# EAGLE design Kimera_core_v1.0 (EAGLE 7.3.0)
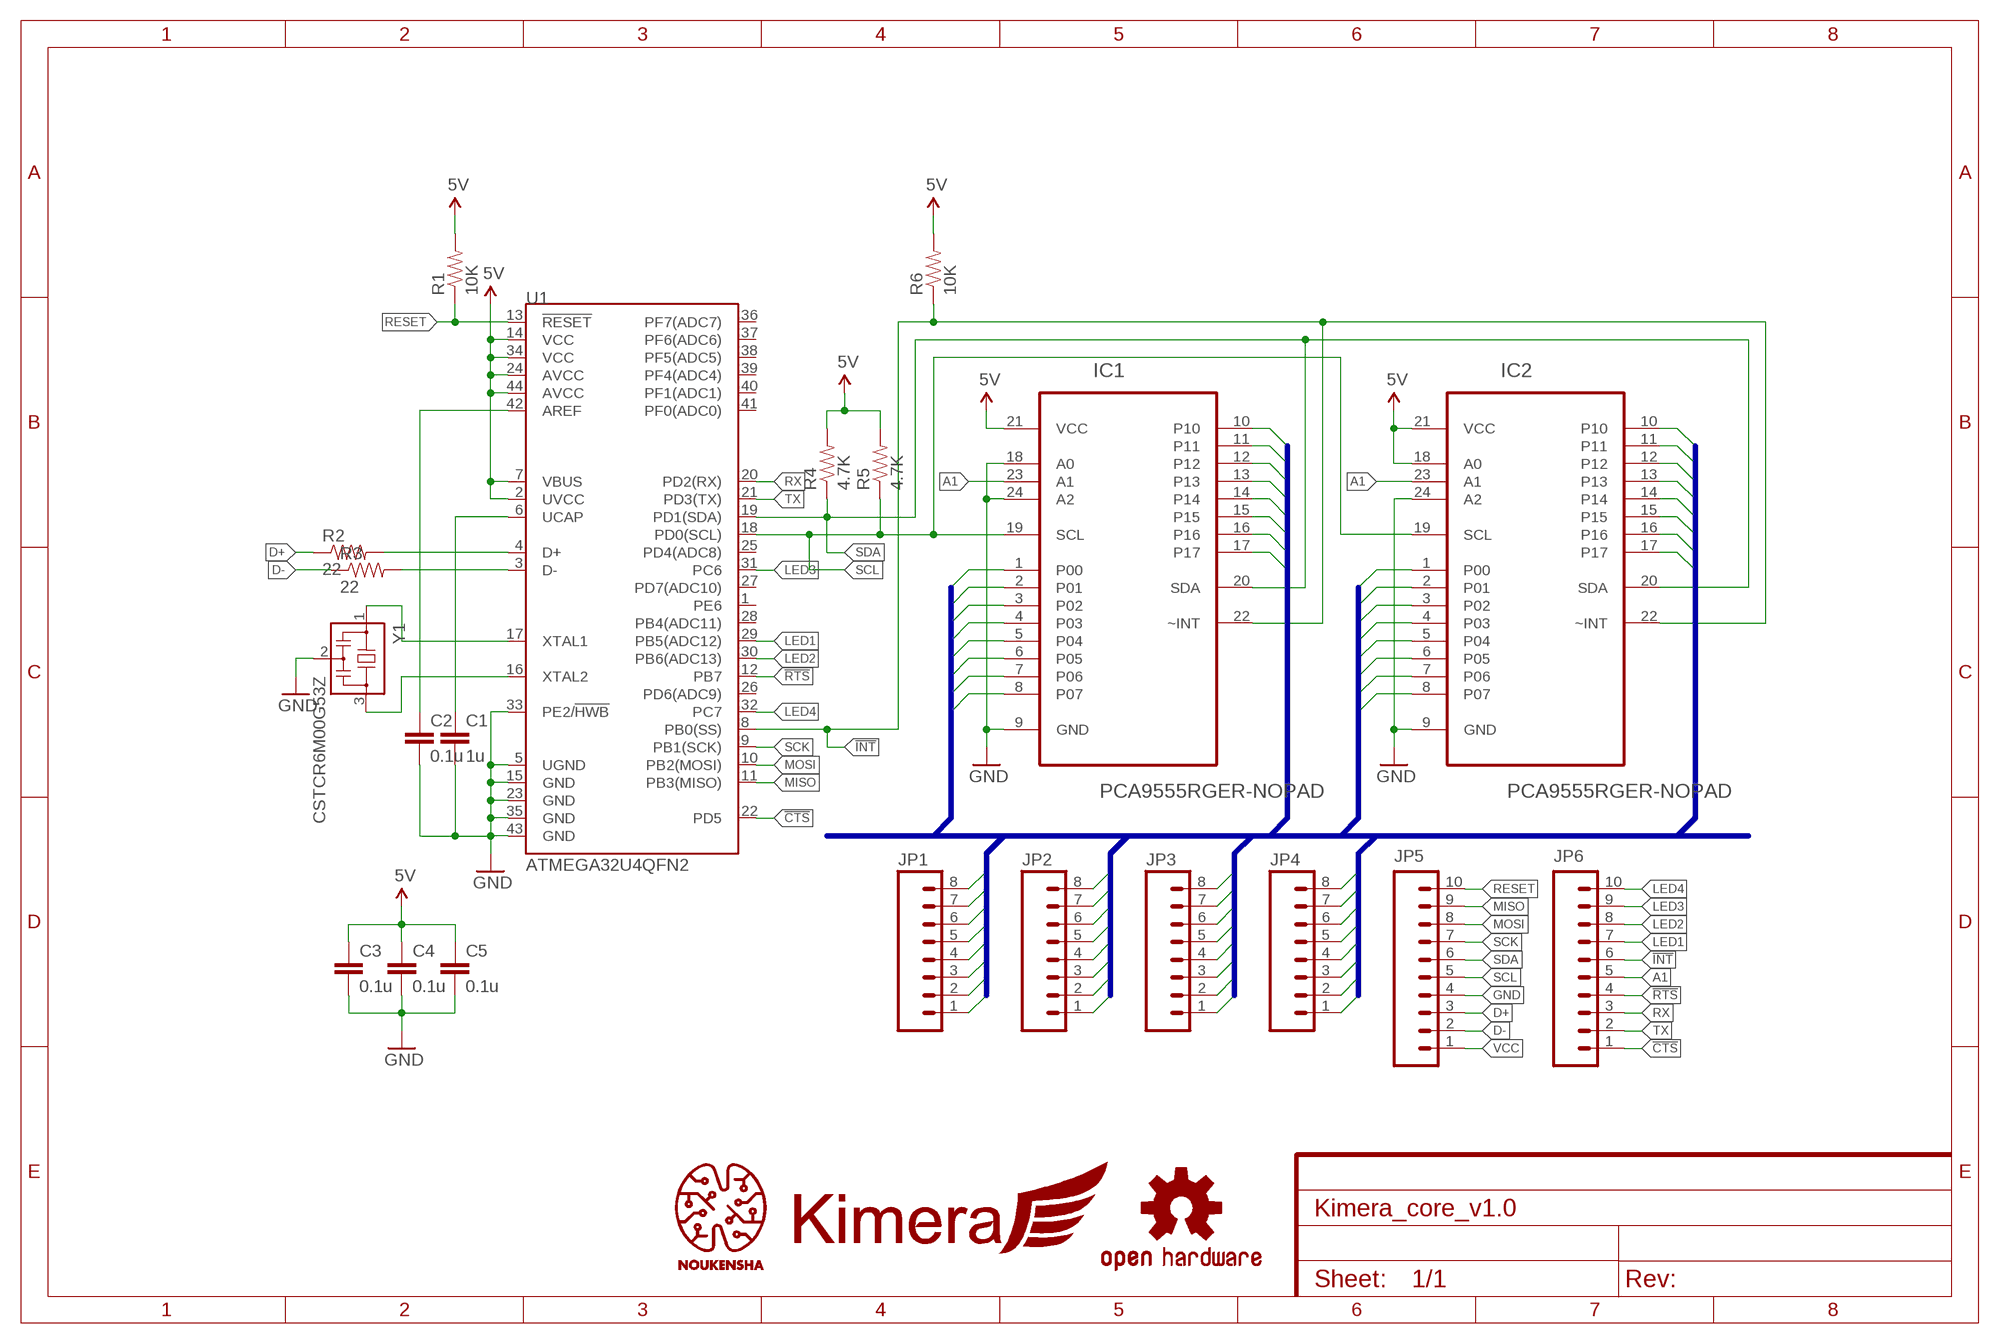
[diagram p0: schematic, sheet 1]
FRAME1 (FRAME-A4L): CNAME: Noukensha; CREVISION: 1.0; DESIGNER: Kai Ryu

## Parts
C1  1u  CAP0402-CAP  [0402-CAP]
C2  0.1u  CAP0402-CAP  [0402-CAP]
C3  0.1u  CAP0402-CAP  [0402-CAP]
C4  0.1u  CAP0402-CAP  [0402-CAP]
C5  0.1u  CAP0402-CAP  [0402-CAP]
IC1  PCA9555RGER-NOPAD  [QFN50P400X400X100-25N-NOPAD]
IC2  PCA9555RGER-NOPAD  [QFN50P400X400X100-25N-NOPAD]
JP1  P08  [P08]
JP2  P08  [P08]
JP3  P08  [P08]
JP4  P08  [P08]
JP5  P10  [P10]
JP6  P10  [P10]
LOGO1  KIMERA_LOGO  [KIMERA_LOGO]
LOGO2  NOUKENSHA_LOGONIX  [NOUKENSHA_LOGO_NIX]
LOGO3  OSHW_LOGONIX  [OSHW_LOGO_NIX]
R1  10K  RESISTOR0402-RES  [0402-RES]
R2  22  RESISTOR0402-RES  [0402-RES]
R3  22  RESISTOR0402-RES  [0402-RES]
R4  4.7K  RESISTOR0402-RES  [0402-RES]
R5  4.7K  RESISTOR0402-RES  [0402-RES]
R6  10K  RESISTOR0402-RES  [0402-RES]
U1  ATMEGA32U4QFN2  [QFN-44-NOPAD]
Y1  CSTCR6M00G53Z  [CSTER12M]

## Nets
!CTS: JP6.1 U1.22(PD5)
!INT: IC1.22(~INT) IC2.22(~INT) JP6.6 R6.1 U1.8(PB0(SS))
!RTS: JP6.4 U1.12(PB7)
A1: IC1.23(A1) IC2.23(A1) JP6.5
D+: JP5.3 R2.1
D-: JP5.2 R3.1
GND: C1.2 C2.2 C3.2 C4.2 C5.2 IC1.9(GND) IC1.18(A0) IC1.24(A2) IC2.9(GND) IC2.24(A2) JP5.4 U1.5(UGND) U1.15(GND) U1.23(GND) U1.33(PE2/!HWB) U1.35(GND) U1.43(GND) Y1.2
LED1: JP6.7 U1.29(PB5(ADC12))
LED2: JP6.8 U1.30(PB6(ADC13))
LED3: JP6.9 U1.31(PC6)
LED4: JP6.10 U1.32(PC7)
MISO: JP5.9 U1.11(PB3(MISO))
MOSI: JP5.8 U1.10(PB2(MOSI))
N$1: C2.1 U1.42(AREF)
N$2: R2.2 U1.4(D+)
N$3: U1.17(XTAL1) Y1.1
N$4: U1.16(XTAL2) Y1.3
N$5: R3.2 U1.3(D-)
N$6: C1.1 U1.6(UCAP)
P1: IC1.1(P00) JP1.1
P2: IC1.2(P01) JP1.2
P3: IC1.3(P02) JP1.3
P4: IC1.4(P03) JP1.4
P5: IC1.5(P04) JP1.5
P6: IC1.6(P05) JP1.6
P7: IC1.7(P06) JP1.7
P8: IC1.8(P07) JP1.8
P9: IC1.10 JP2.1
P10: IC1.11 JP2.2
P11: IC1.12 JP2.3
P12: IC1.13 JP2.4
P13: IC1.14 JP2.5
P14: IC1.15 JP2.6
P15: IC1.16 JP2.7
P16: IC1.17 JP2.8
P17: IC2.1(P00) JP3.1
P18: IC2.2(P01) JP3.2
P19: IC2.3(P02) JP3.3
P20: IC2.4(P03) JP3.4
P21: IC2.5(P04) JP3.5
P22: IC2.6(P05) JP3.6
P23: IC2.7(P06) JP3.7
P24: IC2.8(P07) JP3.8
P25: IC2.10 JP4.1
P26: IC2.11 JP4.2
P27: IC2.12 JP4.3
P28: IC2.13 JP4.4
P29: IC2.14 JP4.5
P30: IC2.15 JP4.6
P31: IC2.16 JP4.7
P32: IC2.17 JP4.8
RESET: JP5.10 R1.1 U1.13(!RESET)
RX: JP6.3 U1.20(PD2(RX))
SCK: JP5.7 U1.9(PB1(SCK))
SCL: IC1.19(SCL) IC2.19(SCL) JP5.5 R5.1 U1.18(PD0(SCL))
SDA: IC1.20(SDA) IC2.20(SDA) JP5.6 R4.1 U1.19(PD1(SDA))
TX: JP6.2 U1.21(PD3(TX))
VCC: C3.1 C4.1 C5.1 IC1.21(VCC) IC2.18(A0) IC2.21(VCC) JP5.1 R1.2 R4.2 R5.2 R6.2 U1.2(UVCC) U1.7(VBUS) U1.14(VCC) U1.24(AVCC) U1.34(VCC) U1.44(AVCC) ; supply symbol labelled 5V
Unconnected: U1.1(PE6) U1.25(PD4(ADC8)) U1.26(PD6(ADC9)) U1.27(PD7(ADC10)) U1.28(PB4(ADC11)) U1.36(PF7(ADC7)) U1.37(PF6(ADC6)) U1.38(PF5(ADC5)) U1.39(PF4(ADC4)) U1.40(PF1(ADC1)) U1.41(PF0(ADC0))

## Buses
P[1..32]

## Library data of the parts
C1-C5 = SparkFun-Passives:CAP: Capacitor Standard 0603 ceramic capacitor, and 0.1" leaded capacitor.
IC1 IC2 = pca9555:PCA9555RGER-NOPAD: 16-BIT I/O EXPANDER
JP1-JP4 = castellation:P08
JP5 JP6 = castellation:P10
LOGO1 = logo:KIMERA_LOGO
LOGO2 = logo:NOUKENSHA_LOGO
LOGO3 = logo:OSHW_LOGO: Open Source Hardware Logo This logo indicates the piece of hardware it is found on incorporates a OSHW license and/or adheres to the definition of open source hardware found here: http://freedomdefined.org/OSHW
R1-R6 = SparkFun-Passives:RESISTOR: Resistor Basic schematic elements and footprints for 0603, 1206, and PTH resistors.
U1 = SparkFun-DigitalIC:ATMEGA32U4: Atmel 44-pin 8-bit Microcontroller with 32KBytes of ISP Flash and USB Controller
Y1 = cstce-resonator:CSTCR: Resonator Source: murata.co.jp; MPN: CSTCC12M0; OC_FARNELL: 1170434; OC_NEWARK: 25M8759

## Board
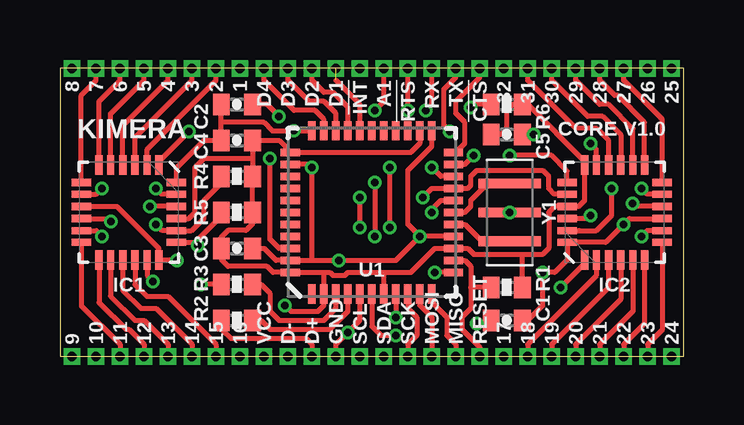
[diagram p1: board, top side]
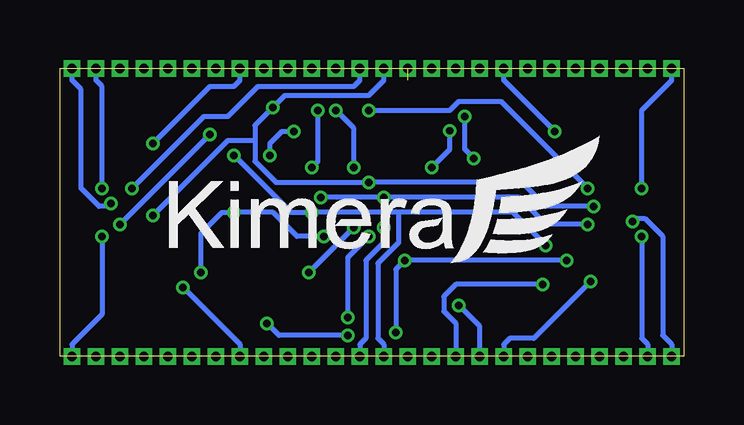
[diagram p2: board, bottom side, seen from below]

Size 26 x 12 mm. Coordinates in mm from the lower left corner, seen from the top.
Outline: 0,0 26,0 26,12 0,12 0,0
Copper layers (1*16): Top 0.035mm / dielectric 1.5mm / Bottom 0.035mm
Design rules "SeeedStudio_2layer_DRU_no_angle_20140221 *": minimum track width 6mil, minimum drill 10mil, track to track 6mil, track to pad 6mil, pad to pad 6mil, via to via 6mil, smd to smd 0mil, copper to edge 0mil, drill to drill 10mil, minimum pad ring 6mil, minimum via ring 5mil, stop-mask expansion 2mil, vias tented up to drill 100mil, thermal gap 10mil

### Footprints (pad centres in the part's own frame; a part is rotated, then mirrored left to right if it is on the bottom)
0402-CAP = smd 0.7 x 0.9: 1 -0.65,0; 2 0.65,0
QFN50P400X400X100-25N-NOPAD = smd 0.813 x 0.305: 1 -1.981,1.245; 2 -1.981,0.762; 3 -1.981,0.254; 4 -1.981,-0.254; 5 -1.981,-0.762; 6 -1.981,-1.245; 13 1.981,-1.245; 14 1.981,-0.762; 15 1.981,-0.254; 16 1.981,0.254; 17 1.981,0.762; 18 1.981,1.245 | smd 0.305 x 0.813: 7 -1.245,-1.981; 8 -0.762,-1.981; 9 -0.254,-1.981; 10 0.254,-1.981; 11 0.762,-1.981; 12 1.245,-1.981; 19 1.245,1.981; 20 0.762,1.981; 21 0.254,1.981; 22 -0.254,1.981; 23 -0.762,1.981; 24 -1.245,1.981
P08 = drill 0.4 pad 0.7 square: 1 0,0; 2 1,0; 3 2,0; 4 3,0; 5 4,0; 6 5,0; 7 6,0; 8 7,0
P10 = drill 0.4 pad 0.7 square: 1 0,0; 2 1,0; 3 2,0; 4 3,0; 5 4,0; 6 5,0; 7 6,0; 8 7,0; 9 8,0; 10 9,0
0402-RES = smd 0.7 x 0.9: 1 -0.65,0; 2 0.65,0
QFN-44-NOPAD = smd 0.8 x 0.3: 1 -3.4,2.5; 2 -3.4,2; 3 -3.4,1.5; 4 -3.4,1; 5 -3.4,0.5; 6 -3.4,0; 7 -3.4,-0.5; 8 -3.4,-1; 9 -3.4,-1.5; 10 -3.4,-2; 11 -3.4,-2.5; 23 3.4,-2.5; 24 3.4,-2; 25 3.4,-1.5; 26 3.4,-1; 27 3.4,-0.5; 28 3.4,0; 29 3.4,0.5; 30 3.4,1; 31 3.4,1.5; 32 3.4,2; 33 3.4,2.5 | smd 0.3 x 0.8: 12 -2.5,-3.4; 13 -2,-3.4; 14 -1.5,-3.4; 15 -1,-3.4; 16 -0.5,-3.4; 17 0,-3.4; 18 0.5,-3.4; 19 1,-3.4; 20 1.5,-3.4; 21 2,-3.4; 22 2.5,-3.4; 34 2.5,3.4; 35 2,3.4; 36 1.5,3.4; 37 1,3.4; 38 0.5,3.4; 39 0,3.4; 40 -0.5,3.4; 41 -1,3.4; 42 -1.5,3.4; 43 -2,3.4; 44 -2.5,3.4
CSTER12M = smd 0.4 x 2.6: 1 -1.2,0; 2 0,0; 3 1.2,0

### Placement (x,y rotation side)
C1  18.62,1.5 0 top
C2  7.38,10.5 180 top
C3  7.38,4.5 0 top
C4  7.38,9 180 top
C5  18.62,9.25 0 top
IC1  2.88,6 270 top
IC2  23.12,6 90 top
JP1  7.5,12 180 top
JP2  0.5,0 0 top
JP3  18.5,0 0 top
JP4  25.5,12 180 top
JP5  8.5,0 0 top
JP6  17.5,12 180 top
LOGO1  22,4 0 bottom
LOGO2  -4.5,-5.5 0 top  (outside the outline)
LOGO3  -5.5,-7 0 top  (outside the outline)
R1  18.62,2.88 0 top
R2  7.38,1.5 0 top
R3  7.38,3 0 top
R4  7.38,7.5 0 top
R5  7.38,6 0 top
R6  18.62,10.5 0 top
U1  13,6 90 top
Y1  18.75,6 270 top

### Tracks (layer width: path | path; a pad name or v marks a point on that pad's centre or on a via)
!CTS
  Top 0.203: U1.22 16.5,8.5 16.88,8.88 16.88,9.75 16.5,10.12 16.5,10.62 17.5,11.62 JP6.1
!INT  (via drill 0.3)
  Top 0.203: IC1.22 v3.75,6.25 | IC2.22 22,5.75 v22.12,5.88 | U1.8 v14,1.62 | v13.12,7.25 v13.12,5 | 17.98,10.47 R6.1 17.25,10.5 v17.12,10.38
  Bottom 0.203: v3.75,6.25 5.75,6.25 6.75,7.25 v13.12,7.25 17,7.25 17.88,8.12 17.88,9 | v14,1.62 14,4.12 v13.12,5 | v22.12,5.88 19,9 17.88,9 | JP6.6 12.5,11.5 13.12,10.88 16.62,10.88 v17.12,10.38 17.88,9.62 17.88,9
!RTS  (via drill 0.3)
  Top 0.203: U1.12 v15.62,3.5 | v13.75,5.38 v13.75,7.88 | v14.5,10.25 JP6.4
  Bottom 0.203: v15.62,3.5 v13.75,5.38 | v13.75,7.88 13.75,9.5 v14.5,10.25
A1  (via drill 0.3)
  Top 0.203: IC1.23 4.24,6.76 v4,7 | 21.64,5.24 IC2.23 22.36,5.24 23,5.88 v23,7 | v13.12,10.25 13.5,10.62 JP6.5
  Bottom 0.203: v4,7 7.62,10.62 9.38,10.62 9.75,10.25 v13.12,10.25 | v23,7 20,10 19,10 17.75,11.25 13.75,11.25 13.5,11.5 JP6.5
D+
  Top 0.203: R2.1 6.72,1.15 7.12,0.75 10.25,0.75 10.5,0.5 JP5.3
D-  (via drill 0.3)
  Top 0.203: R3.1 v5.88,3
  Bottom 0.203: v5.88,3 9.5,3 10,2.5 10,1.88 9.5,1.38 JP5.2
GND  (via drill 0.3)
  Top 0.203: v15,5 14.5,5.5 14.5,7.75 15.5,8.75 U1.23 | 10.5,4 v10.5,7.88 10.38,8 U1.35 | JP5.4 11.5,0.5 v12,1 12.5,1.5 U1.5 | IC1.9 2.37,6.25 4.12,4.5 IC1.18 4.14,4 v4.88,4 | IC2.9 23.75,5.75 v23.5,5.5 22.75,4.75 IC2.24 | C3.2 8.5,4.5 9,4 U1.43 10.5,4 | 6.75,9.03 C4.2 | C4.2 6.72,9.75 | 6.72,9.75 C2.2 | C1.2 19.5,1.5 20.12,2.12 v20.12,3.5 20.62,3.5 21.15,4.02 IC2.24 | 6.72,9.75 8.5,9.75 8.85,9.4 v9.75,9.4 U1.33 | U1.33 | 10.5,4 v11.62,4 14,4 v15,5 | U1.33 | C5.2 v19.75,9.25 | IC2.24 | IC1.24 4.86,7.86 6,9 C4.2 | U1.15 v15,5
  Bottom 0.203: v15,5 16.12,5 17.12,6 Y1.2 19.25,6 20.12,5.12 v20.12,3.5 | v12,1 12,3.62 v11.62,4 v4.88,4 | v10.5,7.88 9.75,8.62 v9.75,9.4 | v23.5,5.5 v19.75,9.25
  other vias: 18.75,6
LED1  (1 unrouted)
  Top 0.203: U1.29 12.5,10.5 11.5,11.5
LED2
  Top 0.203: U1.30 12,10.38 11.38,11 11,11 10.5,11.5 JP6.8
LED3
  Top 0.203: U1.31 11.5,10.12 11,10.62 10.38,10.62 9.5,11.5 JP6.9
LED4
  Top 0.203: U1.32 11,9.88 10.62,10.25 9.75,10.25 8.5,11.5 JP6.10
MISO
  Top 0.203: U1.11 15.5,2.25 16.12,1.62 16.12,0.88 16.5,0.5 JP5.9
MOSI
  Top 0.203: U1.10 15,2.12 15.5,1.62 JP5.8
N$1  (via drill 0.3)
  Top 0.203: U1.42 9.12,4.5 8.75,4.88 v8.75,8.25 | v9.12,10 8.62,10.5 C2.1
  Bottom 0.203: v8.75,8.25 9.12,8.62 v9.12,10
N$2
  Top 0.203: R2.2 8.38,1.5 8.75,1.12 11.25,1.12 12,1.88 U1.4
N$3
  Top 0.203: U1.17 16.88,6 17.12,6.25 17.12,6.5 17.88,7.25 18.7,7.25 Y1.1
N$4
  Top 0.203: U1.16 16.88,5.5 17.62,4.75 18.7,4.75 Y1.3
N$5
  Top 0.203: R3.2 8.38,3 8.75,2.62 8.75,1.88 9.12,1.5 11,1.5 11.5,2 U1.3
N$6  (via drill 0.3)
  Top 0.203: U1.6 13,1.25 13.38,0.88 v14,0.88 | C1.1 17.85,1.38 v17.38,1.38
  Bottom 0.203: v14,0.88 16.88,0.88 v17.38,1.38
P1  (via drill 0.3)
  Top 0.203: v5.38,9.38 4.12,8.12 IC1.1
  Bottom 0.203: v5.38,9.38 7.5,11.5 JP1.1
P2
  Top 0.203: IC1.2 3.64,8.64 6.5,11.5 JP1.2
P3
  Top 0.203: IC1.3 3.13,9.13 5.5,11.5 JP1.3
P4
  Top 0.203: IC1.4 2.62,9.62 4.5,11.5 JP1.4
P5
  Top 0.203: IC1.5 2.11,10.11 3.5,11.5 JP1.5
P6
  Top 0.203: JP1.6 2.5,11.51 1.63,10.63 IC1.6
P7
  Top 0.203: IC1.7 0.89,10.89 1.5,11.5 JP1.7
P8  (via drill 0.3)
  Top 0.203: 0.99,6.76 IC1.8 1.51,6.76 v1.75,7
  Bottom 0.203: v1.75,7 1.75,10.25 0.5,11.5 JP1.8
P9  (via drill 0.3)
  Top 0.203: 0.87,5.75 IC1.10 2,5.75 v2.12,5.62
  Bottom 0.203: v2.12,5.62 2,5.75 1.62,5.75 0.88,5 0.88,0.88 0.5,0.5 JP2.1
P10  (via drill 0.3)
  Top 0.203: 0.99,5.24 IC1.11 1.51,5.24 v1.75,5
  Bottom 0.203: v1.75,5 1.75,0.75 1.5,0.5 JP2.2
P11
  Top 0.203: IC1.12 0.89,2.11 2.5,0.5 JP2.3
P12
  Top 0.203: IC1.13 1.63,2.25 2.75,1.12 2.88,1.12 3.5,0.5 JP2.4
P13
  Top 0.203: IC1.14 2.11,2.51 3.12,1.5 3.5,1.5 4.5,0.5 JP2.5
P14
  Top 0.203: IC1.15 2.62,2.75 3.38,2 4,2 5.5,0.5 JP2.6
P15
  Top 0.203: IC1.16 3.13,3 3.62,2.5 4.5,2.5 6.5,0.5 JP2.7
P16  (via drill 0.3)
  Top 0.203: IC1.17 3.64,3.36 v3.88,3.12
  Bottom 0.203: v3.88,3.12 6.25,0.75 7.25,0.75 7.5,0.5 JP2.8
P17  (via drill 0.3)
  Top 0.203: IC2.1 21.88,3.88 v20.88,2.88
  Bottom 0.203: v20.88,2.88 18.5,0.5 JP3.1
P18
  Top 0.203: IC2.2 22.36,3.36 19.5,0.5 JP3.2
P19
  Top 0.203: IC2.3 22.87,2.87 20.5,0.5 JP3.3
P20
  Top 0.203: IC2.4 23.38,2.38 21.5,0.5 JP3.4
P21
  Top 0.203: IC2.5 23.89,1.89 22.5,0.5 JP3.5
P22
  Top 0.203: IC2.6 24.37,1.37 23.5,0.5 JP3.6
P23
  Top 0.203: IC2.7 25.11,1.11 24.5,0.5 JP3.7
P24  (via drill 0.3)
  Top 0.203: IC2.8 24.49,5.24 v24.25,5
  Bottom 0.203: v24.25,5 24.25,1.75 25.5,0.5 JP3.8
P25  (via drill 0.3)
  Top 0.203: IC2.10 24,6.25 v23.88,6.38
  Bottom 0.203: v23.88,6.38 24,6.25 24.38,6.25 25.12,7 25.12,11.12 25.5,11.5 JP4.1
P26  (via drill 0.3)
  Top 0.203: IC2.11 24.49,6.76 v24.25,7
  Bottom 0.203: v24.25,7 24.25,11.25 24.5,11.5 JP4.2
P27
  Top 0.203: IC2.12 25.11,9.89 23.5,11.5 JP4.3
P28
  Top 0.203: IC2.13 24.37,9.76 23.25,10.88 23.12,10.88 22.5,11.5 JP4.4
P29
  Top 0.203: IC2.14 23.89,9.49 22.88,10.5 22.5,10.5 21.5,11.5 JP4.5
P30
  Top 0.203: JP4.6 20.5,11.5 22,10 22.62,10 23.38,9.25 IC2.15
P31
  Top 0.203: JP4.7 19.5,11.5 21.5,9.5 22.38,9.5 22.87,9 IC2.16
P32  (via drill 0.3)
  Top 0.203: IC2.17 22.36,8.64 v22.12,8.88
  Bottom 0.203: v22.12,8.88 19.75,11.25 18.75,11.25 18.5,11.5 JP4.8
RESET
  Top 0.203: U1.13 16.88,4 17.12,3.75 17.12,2.88 | 17.12,2.88 17.12,2 16.75,1.62 16.75,1.12 17.5,0.38 JP5.10 | R1.1 17.12,2.88
RX  (via drill 0.3)
  Top 0.203: U1.20 15.88,7.5 v15.5,7.88 | v15.25,10.25 15.5,10.5 JP6.3
  Bottom 0.203: v15.5,7.88 15.25,8.12 v15.25,10.25
SCK
  Top 0.203: U1.9 14.5,2 14.88,1.62 14.88,0.88 14.5,0.5 JP5.7
SCL  (via drill 0.3)
  Top 0.203: v15.5,6 15.5,6.12 15.88,6.5 U1.18 | IC1.19 5.63,4.75 | 5.63,4.75 6.72,5.85 R5.1 | 5.63,4.75 v5.75,4.62 | v18.75,8.38 20.5,8.38 21.14,7.73 IC2.19
  Bottom 0.203: 11.88,6 v15.5,6 16.38,6 v18.75,8.38 | v5.75,4.62 7.12,6 11.88,6 | JP5.5 12.5,0.5 12.75,0.75 12.75,3.88 11.88,4.75 11.88,6
SDA  (via drill 0.3)
  Top 0.203: v15.12,6.62 15.5,7 U1.19 17,7 17.12,7.12 17.12,7.5 17.38,7.75 20.12,7.75 20.38,7.5 20.38,7 20.61,6.76 IC2.20 | R4.1 6.72,7.22 6,6.5 6,5.75 5.49,5.24 IC1.20 4.26,5.24 v4,5.5 | v12.5,5.38 v12.5,6.62
  Bottom 0.203: v12.5,5.38 12.5,4.75 13.25,4 13.25,0.75 13.5,0.5 JP5.6 | v4,5.5 5.75,5.5 6.88,6.62 v12.5,6.62 v15.12,6.62
TX  (via drill 0.3)
  Top 0.203: v16.25,9.38 16,9.62 16,11.12 16.5,11.62 JP6.2 | U1.21 16.88,8 v17.25,8.38
  Bottom 0.203: v17.25,8.38 17.25,8.88 16.75,9.38 v16.25,9.38
VCC  (via drill 0.3)
  Top 0.203: v9.38,2.12 9.62,1.88 10.75,1.88 11,2.12 U1.2 11,3.5 | 19.27,4.25 17.25,4.25 17,4.5 U1.14 15.62,4.5 14.62,3.5 13.5,3.5 | 19.27,4.25 20.12,4.25 20.38,4.5 20.38,6 20.63,6.25 IC2.21 21.63,6.25 21.88,6.5 IC2.18 21.88,8.12 19.5,10.5 R6.2 18.88,10.5 18.62,10.25 18.62,9.5 18.38,9.25 C5.1 | 8.03,8.25 C4.1 9.12,9 9.6,8.53 U1.34 14.62,8.5 15,8.88 U1.24 | 8.03,8.25 R4.2 R5.2 8.03,5.53 7.75,5.25 7,5.25 6.72,4.97 C3.1 6.75,4.47 6.75,4 7,3.75 8.62,3.75 8.88,3.5 U1.44 11,3.5 | IC1.21 5.37,5.75 5.62,6 5.62,7.88 6,8.25 8.03,8.25 | R1.2 19.27,4.25 | 11,3.5 11.25,3.5 11.38,3.38 11.88,3.38 12,3.5 13.5,3.5 | U1.7 13.5,3.5
  Bottom 0.203: JP5.1 8.5,1.25 v9.38,2.12

### Text on the board
tNames: 8 | 7 | 6 | 5 | 4 | 3 | 2 | 1 | D4 | D3 | D2 | D1 | !INT | A1 | !RTS | RX | TX | !CTS | 32 | 31 | 30 | 29 | 28 | 27 | 26 | 25 | KIMERA | CORE V1.0 | 9 | 10 | 11 | 12 | 13 | 14 | 15 | 16 | VCC | D- | D+ | GND | SCL | SDA | SCK | MOSI | MISO | RESET | 17 | 18 | 19 | 20 | 21 | 22 | 23 | 24